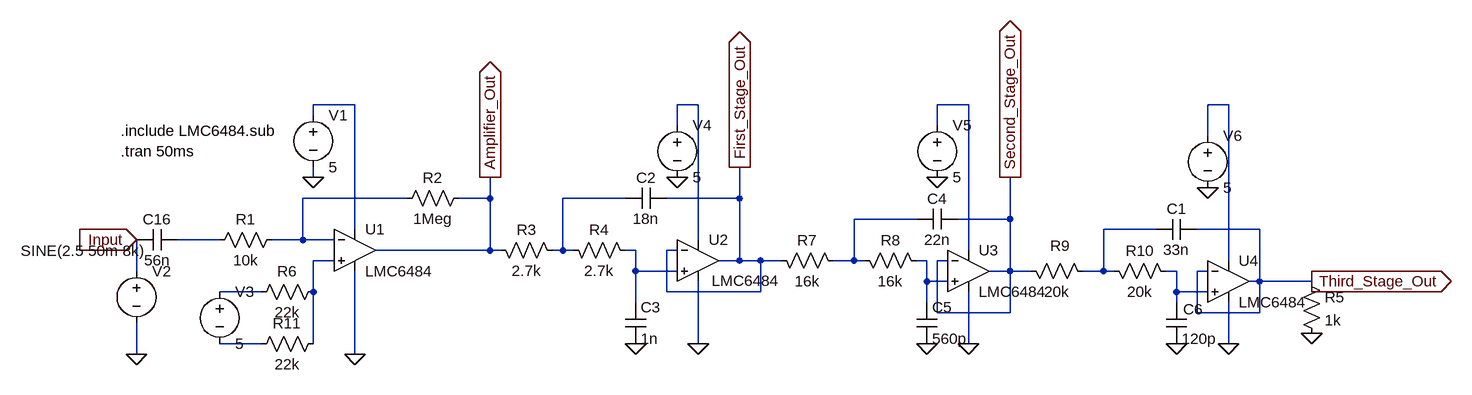
[diagram p0: schematic LMC6484.asc]
LMC6484.asc, the LTspice schematic file:
Version 4
SHEET 1 1836 680
WIRE 80 0 16 0
WIRE 608 0 576 0
WIRE 1024 0 976 0
WIRE 1424 0 1392 0
WIRE 16 16 16 0
WIRE 576 32 576 0
WIRE 976 32 976 0
WIRE 1392 48 1392 0
WIRE 16 112 16 96
WIRE 160 144 0 144
WIRE 288 144 288 112
WIRE 288 144 240 144
WIRE 496 144 400 144
WIRE 672 144 672 96
WIRE 672 144 560 144
WIRE 944 176 848 176
WIRE 1088 176 1088 112
WIRE 1088 176 1008 176
WIRE 80 192 80 0
WIRE 1312 192 1232 192
WIRE 1472 192 1376 192
WIRE -128 208 -192 208
WIRE 0 208 0 144
WIRE 0 208 -48 208
WIRE 48 208 0 208
WIRE 608 208 608 0
WIRE 288 224 288 144
WIRE 288 224 112 224
WIRE 304 224 288 224
WIRE 400 224 400 144
WIRE 400 224 384 224
WIRE 416 224 400 224
WIRE 512 224 496 224
WIRE 576 224 560 224
WIRE 1024 224 1024 0
WIRE 48 240 16 240
WIRE 672 240 672 144
WIRE 672 240 640 240
WIRE 704 240 672 240
WIRE 736 240 704 240
WIRE 848 240 848 176
WIRE 848 240 816 240
WIRE 864 240 848 240
WIRE 960 240 944 240
WIRE 992 240 976 240
WIRE 1424 240 1424 0
WIRE -256 256 -256 208
WIRE 512 256 512 224
WIRE 576 256 512 256
WIRE 1088 256 1088 176
WIRE 1088 256 1056 256
WIRE 1120 256 1088 256
WIRE 1232 256 1232 192
WIRE 1232 256 1200 256
WIRE 1248 256 1232 256
WIRE 1344 256 1328 256
WIRE 1392 256 1376 256
WIRE 960 272 960 240
WIRE 992 272 960 272
WIRE 1472 272 1472 192
WIRE 1472 272 1456 272
WIRE 1552 272 1472 272
WIRE -64 288 -128 288
WIRE 16 288 16 240
WIRE 560 288 560 224
WIRE 704 288 704 240
WIRE 704 288 560 288
WIRE 1344 288 1344 256
WIRE 1392 288 1344 288
WIRE 512 304 512 256
WIRE 960 304 960 272
WIRE 1344 304 1344 288
WIRE 976 320 976 240
WIRE 1088 320 1088 256
WIRE 1088 320 976 320
WIRE 1376 320 1376 256
WIRE 1472 320 1472 272
WIRE 1472 320 1376 320
WIRE -64 368 -128 368
WIRE 16 368 16 288
WIRE 608 368 608 272
WIRE 1024 368 1024 288
WIRE 1424 368 1424 304
WIRE -256 384 -256 336
WIRE 80 384 80 256
FLAG 80 384 0
FLAG -256 384 0
FLAG 16 112 0
FLAG 512 368 0
FLAG 576 112 0
FLAG 608 368 0
FLAG 960 368 0
FLAG 1024 368 0
FLAG 976 112 0
FLAG 1552 272 Third_Stage_Out
IOPIN 1552 272 Out
FLAG 1088 112 Second_Stage_Out
IOPIN 1088 112 Out
FLAG 672 96 First_Stage_Out
IOPIN 672 96 Out
FLAG 288 112 Amplifier_Out
IOPIN 288 112 Out
FLAG 1344 368 0
FLAG 1424 368 0
FLAG 1392 128 0
FLAG -256 208 Input
IOPIN -256 208 In
FLAG 1552 352 0
SYMBOL Opamps\\opamp2 80 160 R0
SYMATTR InstName U1
SYMATTR Value LMC6484
SYMBOL voltage 16 0 R0
WINDOW 123 0 0 Left 0
WINDOW 39 0 0 Left 0
SYMATTR InstName V1
SYMATTR Value 5
SYMBOL res -32 192 R90
WINDOW 0 0 56 VBottom 2
WINDOW 3 32 56 VTop 2
SYMATTR InstName R1
SYMATTR Value 10k
SYMBOL res 256 128 R90
WINDOW 0 0 56 VBottom 2
WINDOW 3 32 56 VTop 2
SYMATTR InstName R2
SYMATTR Value 1Meg
SYMBOL voltage -256 240 R0
WINDOW 3 -178 -15 Left 2
WINDOW 123 -106 -102 Left 2
WINDOW 39 0 0 Left 2
SYMATTR Value SINE(2.5 50m 8k)
SYMATTR InstName V2
SYMBOL Opamps\\opamp2 608 176 R0
WINDOW 3 21 95 Left 2
SYMATTR Value LMC6484
SYMATTR InstName U2
SYMBOL Opamps\\opamp2 1024 192 R0
SYMATTR InstName U3
SYMATTR Value LMC6484
SYMBOL Opamps\\opamp2 1424 208 R0
SYMATTR InstName U4
SYMATTR Value LMC6484
SYMBOL res 288 208 M90
WINDOW 0 0 56 VBottom 2
WINDOW 3 32 56 VTop 2
SYMATTR InstName R3
SYMATTR Value 2.7k
SYMBOL res 400 208 M90
WINDOW 0 0 56 VBottom 2
WINDOW 3 32 56 VTop 2
SYMATTR InstName R4
SYMATTR Value 2.7k
SYMBOL res 720 224 M90
WINDOW 0 0 56 VBottom 2
WINDOW 3 32 56 VTop 2
SYMATTR InstName R7
SYMATTR Value 16k
SYMBOL res 848 224 M90
WINDOW 0 0 56 VBottom 2
WINDOW 3 32 56 VTop 2
SYMATTR InstName R8
SYMATTR Value 16k
SYMBOL res 1104 240 M90
WINDOW 0 -7 61 VBottom 2
WINDOW 3 32 56 VTop 2
SYMATTR InstName R9
SYMATTR Value 20k
SYMBOL res 1232 240 M90
WINDOW 0 0 56 VBottom 2
WINDOW 3 32 56 VTop 2
SYMATTR InstName R10
SYMATTR Value 20k
SYMBOL cap 1376 176 R90
WINDOW 0 0 32 VBottom 2
WINDOW 3 32 32 VTop 2
SYMATTR InstName C1
SYMATTR Value 33n
SYMBOL cap 560 128 R90
WINDOW 0 0 32 VBottom 2
WINDOW 3 32 32 VTop 2
SYMATTR InstName C2
SYMATTR Value 18n
SYMBOL cap 496 304 R0
SYMATTR InstName C3
SYMATTR Value 1n
SYMBOL cap 1008 160 R90
WINDOW 0 0 32 VBottom 2
WINDOW 3 32 32 VTop 2
SYMATTR InstName C4
SYMATTR Value 22n
SYMBOL cap 944 304 R0
SYMATTR InstName C5
SYMATTR Value 560p
SYMBOL cap 1328 304 R0
WINDOW 0 26 11 Left 2
SYMATTR InstName C6
SYMATTR Value 120p
SYMBOL voltage 576 16 R0
WINDOW 123 0 0 Left 0
WINDOW 39 0 0 Left 0
SYMATTR InstName V4
SYMATTR Value 5
SYMBOL cap -192 192 R90
WINDOW 0 0 32 VBottom 2
WINDOW 3 32 32 VTop 2
SYMATTR InstName C16
SYMATTR Value 56n
SYMBOL voltage 976 16 R0
WINDOW 123 0 0 Left 0
WINDOW 39 0 0 Left 0
SYMATTR InstName V5
SYMATTR Value 5
SYMBOL voltage 1392 32 R0
WINDOW 123 0 0 Left 0
WINDOW 39 0 0 Left 0
SYMATTR InstName V6
SYMATTR Value 5
SYMBOL res 1536 256 R0
SYMATTR InstName R5
SYMATTR Value 1k
SYMBOL voltage -128 272 R0
WINDOW 123 0 0 Left 0
WINDOW 39 0 0 Left 0
SYMATTR InstName V3
SYMATTR Value 5
SYMBOL res 32 272 R90
WINDOW 0 0 56 VBottom 2
WINDOW 3 32 56 VTop 2
SYMATTR InstName R6
SYMATTR Value 22k
SYMBOL res 32 352 R90
WINDOW 0 0 56 VBottom 2
WINDOW 3 32 56 VTop 2
SYMATTR InstName R11
SYMATTR Value 22k
TEXT -280 40 Left 2 !.include LMC6484.sub
TEXT -280 72 Left 2 !.tran 50ms

The netlist it stands for:
* LMC6484.asc
XU1 N011 N005 N001 0 Amplifier_Out LMC6484  ; pins In+ In- V+ V- OUT
V1 N001 0 5
R1 N005 N009 10k
R2 Amplifier_Out N005 1Meg
V2 Input 0 SINE(2.5 50m 8k)
XU2 N010 First_Stage_Out N002 0 First_Stage_Out LMC6484  ; pins In+ In- V+ V- OUT
XU3 N012 Second_Stage_Out N003 0 Second_Stage_Out LMC6484  ; pins In+ In- V+ V- OUT
XU4 N013 Third_Stage_Out N004 0 Third_Stage_Out LMC6484  ; pins In+ In- V+ V- OUT
R3 Amplifier_Out N006 2.7k
R4 N006 N010 2.7k
R7 First_Stage_Out N007 16k
R8 N007 N012 16k
R9 Second_Stage_Out N008 20k
R10 N008 N013 20k
C1 Third_Stage_Out N008 33n
C2 First_Stage_Out N006 18n
C3 N010 0 1n
C4 Second_Stage_Out N007 22n
C5 N012 0 560p
C6 N013 0 120p
V4 N002 0 5
C16 N009 Input 56n
V5 N003 0 5
V6 N004 0 5
R5 Third_Stage_Out 0 1k
V3 N014 N015 5
R6 N011 N014 22k
R11 N011 N015 22k
.include LMC6484.sub
.tran 50ms
.backanno
.end